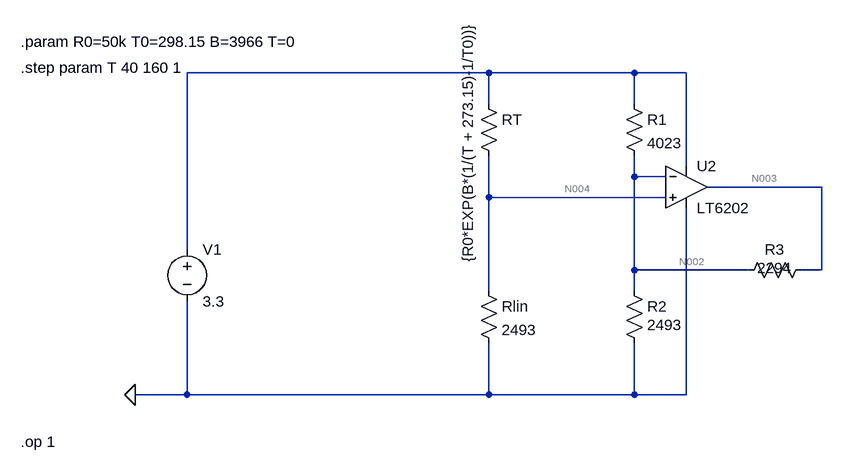
[diagram p0: schematic linearize.asc]
* linearize.asc
RT N001 N004 {R0*EXP(B*(1/(T + 273.15)-1/T0))}
V1 N001 0 3.3
Rlin N004 0 2493
R2 N002 0 2493
R1 N001 N002 4023
R3 N003 N002 2294
* U2: LT6202 (symbol OpAmps\LT6202 not available, pins judged from their places): In+=N004 In-=N002 V+=N001 V-=0 OUT=N003
.param R0=50k T0=298.15 B=3966 T=0
.step param T 40 160 1
.op 1
.backanno
.end

* Results of the author's LTspice run, read from the files saved beside the schematic
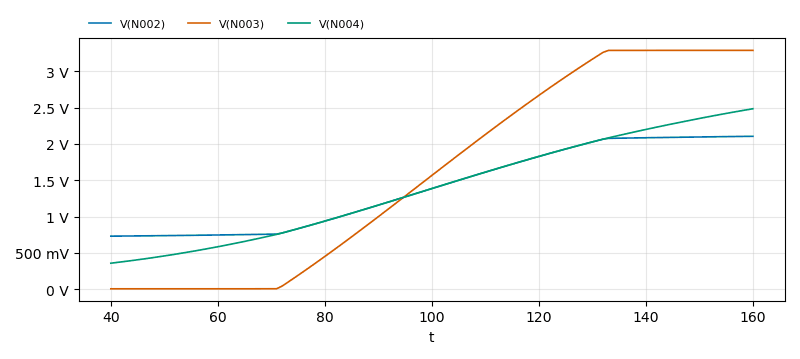
[diagram p1: Operating Point of linearize.asc, plotted from the saved traces]
* Operating Point, 1 run:
*   V(N002): 731.3 mV at t=40 , 2.106 V at t=160 , min 731.3 mV, max 2.106 V
*   V(N003): 6.628 mV at t=40 , 3.289 V at t=160 , min 6.628 mV, max 3.289 V
*   V(N004): 359.3 mV at t=40 , 2.485 V at t=160 , min 359.3 mV, max 2.485 V
* From the log:
*   Semiconductor Device Operating Points:
*                           --- Diodes ---
*   Name:    d:u2:8      d:u2:5      d:u2:3      d:u2:16     d:u2:15
*   Model:  u2:dbia3    u2:dbia3    u2:dbia2    u2:dbia2     u2:din
*   Id:      1.44e-09    1.81e-09    1.40e-06    1.40e-06   -3.72e-12
*   Vd:      1.44e+00    1.81e+00    1.44e+00    1.81e+00   -3.72e-01
*   Req:     1.00e-09    1.00e-09    1.00e-04    1.00e-04    1.00e-11
*   CAP:     0.00e+00    0.00e+00    0.00e+00    0.00e+00    0.00e+00
*   Name:    d:u2:14     d:u2:7      d:u2:2      d:u2:1      d:u2:13
*   Model:  u2:dlimp      u2:dp      u2:desd     u2:desd     u2:desd
*   Id:     -2.81e-07    1.25e-03   -8.04e-15   -8.04e-15   -2.83e-14
*   Vd:     -4.15e-01    3.30e+00   -7.31e-01   -7.31e-01   -2.57e+00
*   Req:     1.00e-05    1.00e-03    1.00e-14    1.00e-14    1.00e-14
*   CAP:     0.00e+00    0.00e+00    0.00e+00    0.00e+00    0.00e+00
*   Name:    d:u2:12     d:u2:6      d:u2:11     d:u2:10     d:u2:4
*   Model:   u2:desd    u2:dlimn    u2:dbia1    u2:dbia1    u2:dbiaz
*   Id:     -3.23e-14    4.04e-08   -1.44e-07   -1.81e-07    2.20e-04
*   Vd:     -2.94e+00    2.69e+00   -1.44e+00   -1.81e+00    1.13e+00
*   Req:     1.00e-14    1.00e-06    1.00e-07    1.00e-07    1.00e-02
*   CAP:     0.00e+00    0.00e+00    0.00e+00    0.00e+00    0.00e+00
*                           --- VDMOSFET Transistors ---
*   Name:        m:u2:2      m:u2:1
*   Model:        u2:pi       u2:ni
*   Id:         -3.29e-12    3.16e-04
*   Vgs:         4.15e-01    2.69e+00
*   Vds:        -3.29e+00    6.63e-03
*   Vth:        -3.00e-01    3.00e-01
*   Gm:          0.00e+00    1.33e-04
*   Gds:         0.00e+00    4.76e-02
*   Cgs:         0.00e+00    0.00e+00
*   Cgd:         0.00e+00    0.00e+00
*   Cbody:       0.00e+00    0.00e+00